# Altium schematic sheet Regulator.SchDoc
size A1
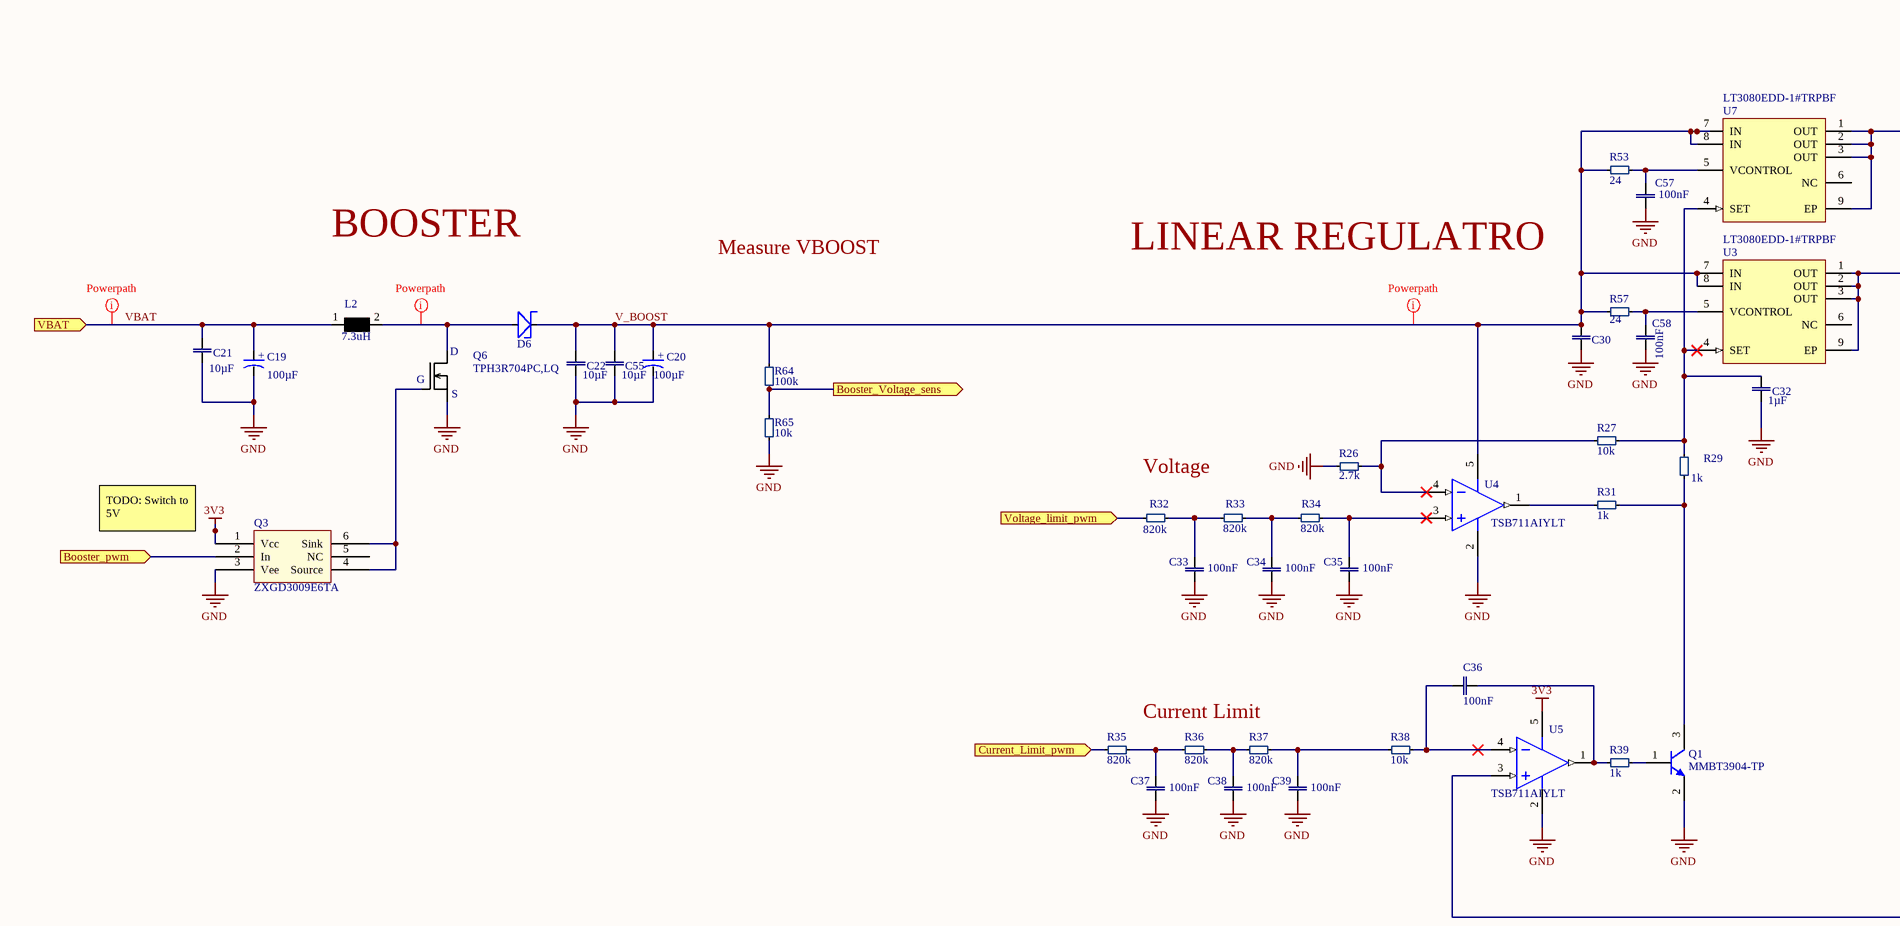
[diagram p0: Regulator.SchDoc, left]
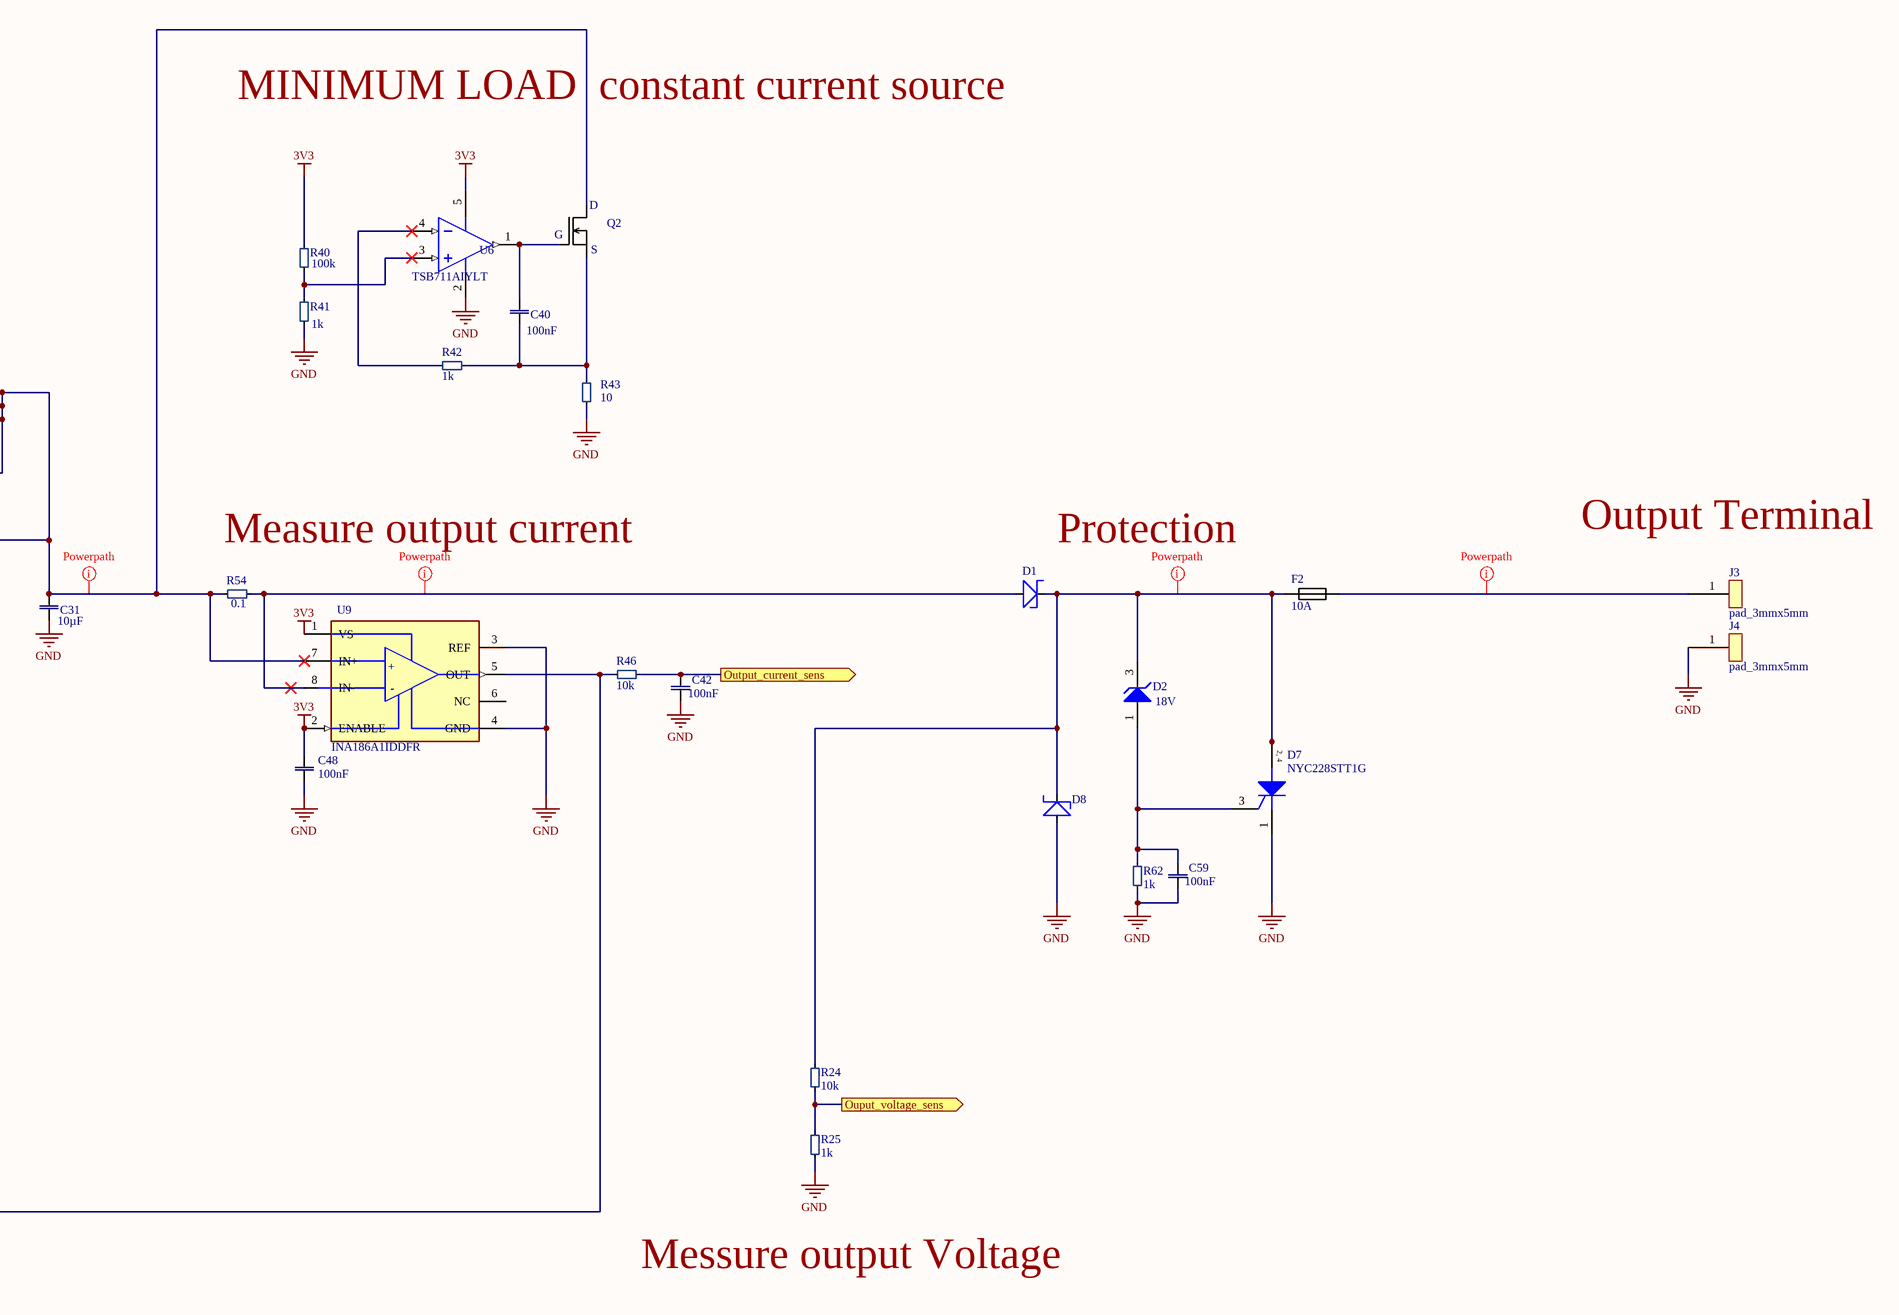
[diagram p1: Regulator.SchDoc, right]

## Parts
C19  Capacitance: 100µF  [CAPAE7966X77N]  (hidden comment: 865080545012)
C20  Capacitance: 100µF  [CAPAE7966X77N]  (hidden comment: 865080545012)
C21  Capacitance: 10µF  [Chip2PinSM127P600-8N]  (hidden comment: CL31A106MBHNNNE)
C22  Capacitance: 10µF  [Chip2PinSM127P600-8N]  (hidden comment: CL31A106MBHNNNE)
C30  CL21B105KBFNNNG  [CAP0805]  (value not drawn)
C31  Capacitance: 10µF  [Chip2PinSM127P600-8N]  (hidden comment: CL31A106MBHNNNE)
C32  Capacitance: 1µF  [CAP0805]  (hidden comment: CL21B105KBFNNNG)
C33  Capacitance: 100nF  [cap0402]  (hidden comment: GRM155R71H104ME14D)
C34  Capacitance: 100nF  [cap0402]  (hidden comment: GRM155R71H104ME14D)
C35  Capacitance: 100nF  [cap0402]  (hidden comment: GRM155R71H104ME14D)
C36  Capacitance: 100nF  [cap0402]  (hidden comment: GRM155R71H104ME14D)
C37  Capacitance: 100nF  [cap0402]  (hidden comment: GRM155R71H104ME14D)
C38  Capacitance: 100nF  [cap0402]  (hidden comment: GRM155R71H104ME14D)
C39  Capacitance: 100nF  [cap0402]  (hidden comment: GRM155R71H104ME14D)
C40  Capacitance: 100nF  [cap0402]  (hidden comment: GRM155R71H104ME14D)
C42  Capacitance: 100nF  [cap0402]  (hidden comment: GRM155R71H104ME14D)
C48  Capacitance: 100nF  [cap0402]  (hidden comment: GRM155R71H104ME14D)
C55  Capacitance: 10µF  [Chip2PinSM127P600-8N]  (hidden comment: CL31A106MBHNNNE)
C57  Capacitance: 100nF  [cap0402]  (hidden comment: GRM155R71H104ME14D)
C58  Capacitance: 100nF  [cap0402]  (hidden comment: GRM155R71H104ME14D)
C59  Capacitance: 100nF  [cap0402]  (hidden comment: GRM155R71H104ME14D)
D1  MBR12100LPS-TP  [DFN445P552X120-3N]  (value not drawn)
D2  Vz: 18V  [ONSC-SOT-23-3-318-08_V]  (hidden comment: BZX84C18LT3G)
D6  MBR12100LPS-TP  [DFN445P552X120-3N]  (value not drawn)
D7  NYC228STT1G  [ONSC-SOT-223-4-318E-04_V]
D8  MBR12100LPS-TP  [DFN445P552X120-3N]  (value not drawn)
F2  current rating: 10A  [RESC3216X06N]  (hidden comment: 0685H9100-01)
J3  pad_3mmx5mm  [pad_3mmx5mm-Footprint-1]  (no BOM)
J4  pad_3mmx5mm  [pad_3mmx5mm-Footprint-1]  (no BOM)
L2  Inductance: 7.3uH  [INDP130128X65N]  (hidden comment: 7443551730)
Q1  MMBT3904-TP  [ONSC-SOT-23-3-318-08_V]
Q2  PMN55ENEX  [TSOP95P280X110-6N_PMN55ENE]  (value not drawn)
Q3  ZXGD3009E6TA  [SOT95P285X110-6N]
Q6  TPH3R704PC,LQ  [TPH3R704PC,LQ-Footprint-1]
R24  Resistance: 10k  [SMD_0402(1005)_M]  (hidden comment: RC0402FR-0710KL)
R25  Resistance: 1k  [SMD_0402(1005)_M]  (hidden comment: RC0402FR-071KL)
R26  Resistance: 2.7k  [RESC1005X40X25NL05T10]  (hidden comment: RC0402FR-072K7L)
R27  Resistance: 10k  [SMD_0402(1005)_M]  (hidden comment: RC0402FR-0710KL)
R29  Resistance: 1k  [SMD_0402(1005)_M]  (hidden comment: RC0402FR-071KL)
R31  Resistance: 1k  [SMD_0402(1005)_M]  (hidden comment: RC0402FR-071KL)
R32  Resistance: 820k  [SMD_0402(1005)_M]  (hidden comment: RC0402FR-07820KL)
R33  Resistance: 820k  [SMD_0402(1005)_M]  (hidden comment: RC0402FR-07820KL)
R34  Resistance: 820k  [SMD_0402(1005)_M]  (hidden comment: RC0402FR-07820KL)
R35  Resistance: 820k  [SMD_0402(1005)_M]  (hidden comment: RC0402FR-07820KL)
R36  Resistance: 820k  [SMD_0402(1005)_M]  (hidden comment: RC0402FR-07820KL)
R37  Resistance: 820k  [SMD_0402(1005)_M]  (hidden comment: RC0402FR-07820KL)
R38  Resistance: 10k  [SMD_0402(1005)_M]  (hidden comment: RC0402FR-0710KL)
R39  Resistance: 1k  [SMD_0402(1005)_M]  (hidden comment: RC0402FR-071KL)
R40  Resistance: 100k  [SMD_0402(1005)_M]  (hidden comment: RC0402FR-07100KL)
R41  Resistance: 1k  [SMD_0402(1005)_M]  (hidden comment: RC0402FR-071KL)
R42  Resistance: 1k  [SMD_0402(1005)_M]  (hidden comment: RC0402FR-071KL)
R43  Resistance: 10  [SMD_0402(1005)_M]  (hidden comment: RC0402FR-0710RL)
R46  Resistance: 10k  [SMD_0402(1005)_M]  (hidden comment: RC0402FR-0710KL)
R53  Resistance: 24  [RESC0402(1005)_N]  (hidden comment: RC0402FR-0724RL)
R54  Resistance: 0.1  [Chip2PinSM127P600-8N]  (hidden comment: ERJ-8BSFR10V)
R57  Resistance: 24  [RESC0402(1005)_N]  (hidden comment: RC0402FR-0724RL)
R62  Resistance: 1k  [SMD_0402(1005)_M]  (hidden comment: RC0402FR-071KL)
R64  Resistance: 100k  [SMD_0402(1005)_M]  (hidden comment: RC0402FR-07100KL)
R65  Resistance: 10k  [SMD_0402(1005)_M]  (hidden comment: RC0402FR-0710KL)
U3  LT3080EDD-1#TRPBF  [LT-DD-8_V]
U4  TSB711AIYLT  [DBV0005A_N]
U5  TSB711AIYLT  [DBV0005A_N]
U6  TSB711AIYLT  [DBV0005A_N]
U7  LT3080EDD-1#TRPBF  [LT-DD-8_V]
U9  INA186A1IDDFR  [FP-DDF0008A-IPC_C]

## Ports
Booster_pwm (in), Booster_Voltage_sens (out), Current_Limit_pwm (in), Ouput_voltage_sens (out), Output_current_sens (out), VBAT (in), Voltage_limit_pwm (in)

## Nets
3V3: C48.2 Q3.1(Vcc) R40.2 U5.5(V+) U6.5(V+) U9.1(VS) U9.2(ENABLE)
GND: C19.2(-) C20.2(-) C21.1 C22.1 C30.1 C31.1 C32.1 C33.1 C34.1 C35.1 C37.1 C38.1 C39.1 C42.1 C48.1 C55.1 C57.1 C58.1 C59.1 D7.1(K) D8.2(A) J4.1 Q1.2(E) Q3.3(Vee) Q6.1(D) R25.1 R26.1 R41.1 R43.1 R62.1 R65.1 U4.2(V-) U5.2(V-) U6.2(V-) U9.3(REF) U9.4(GND)
Booster_pwm: Q3.2(In) ; port Booster_pwm
Booster_Voltage_sens: R64.1 R65.2 ; port Booster_Voltage_sens
Current_Limit_pwm: R35.1 ; port Current_Limit_pwm
Ouput_voltage_sens: R24.1 R25.2 ; port Ouput_voltage_sens
Output_current_sens: C42.2 R46.1 ; port Output_current_sens
V_BOOST: C20.1(+) C22.2 C30.2 C55.2 D6.1(K) R53.1 R57.1 R64.2 U3.7(IN) U3.8(IN) U4.5(V+) U7.7(IN) U7.8(IN)
VBAT: C19.1(+) C21.2 L2.1 ; port VBAT
Voltage_limit_pwm: R32.1 ; port Voltage_limit_pwm
NetC31_2: C31.2 Q2.2(S) R54.1 U3.1(OUT) U3.2(OUT) U3.3(OUT) U3.9(EP) U7.1(OUT) U7.2(OUT) U7.3(OUT) U7.9(EP) U9.7(IN+)
NetC32_2: C32.2 R27.2 R29.2 U3.4(SET) U7.4(SET)
NetC33_2: C33.2 R32.2 R33.1
NetC34_2: C34.2 R33.2 R34.1
NetC35_2: C35.2 R34.2 U4.3(IN+)
NetC36_1: C36.1 R39.2 U5.1(OUT)
NetC36_2: C36.2 R38.2 U5.4(IN-)
NetC37_2: C37.2 R35.2 R36.1
NetC38_2: C38.2 R36.2 R37.1
NetC39_2: C39.2 R37.2 R38.1
NetC40_1: C40.1 Q2.1(D) R42.1 R43.2
NetC40_2: C40.2 Q2.3(G) U6.1(OUT)
NetC57_2: C57.2 R53.2 U7.5(VCONTROL)
NetC58_2: C58.2 R57.2 U3.5(VCONTROL)
NetC59_2: C59.2 D2.1(A) D7.3(G) R62.2
NetD1_1: D1.1(K) D2.3(K) D7.2(A) D7.4(A) D8.1(K) F2.1 R24.2
NetD1_2: D1.2(A) R54.2 U9.8(IN-)
NetD6_2: D6.2(A) L2.2 Q6.2(S)
NetF2_2: F2.2 J3.1
NetQ1_1: Q1.1(B) R39.1
NetQ1_3: Q1.3(C) R29.1 R31.1
NetQ3_4: Q3.4(Source) Q3.6(Sink) Q6.3(G)
NetR26_2: R26.2 R27.1 U4.4(IN-)
NetR31_2: R31.2 U4.1(OUT)
NetR40_1: R40.1 R41.2 U6.3(IN+)
NetR42_2: R42.2 U6.4(IN-)
NetR46_2: R46.2 U5.3(IN+) U9.5(OUT)

Not connected (* = marked no-connect by the designer): Q3 5(NC); U3 6(NC); U7 6(NC); U9 6(NC)

## Layout directives
net class Powerpath: NetC31_2, NetD1_1, NetD1_2, NetD6_2, NetF2_2, V_BOOST, VBAT

## Notes on the sheet
- MINIMUM LOAD  constant current source
- BOOSTER
- Measure VBOOST
- LINEAR REGULATRO
- (near R54) Measure output current
- Protection
- Output Terminal
- Voltage
- TODO: Switch to 5V
- Current Limit
- Messure output Voltage
- (in symbol CMP-00013-1) 2, 4
- (in symbol CMP-ROOT-00032-7) +; -

## Library data of the parts
C19 C20 = CMP-0001-00027-2: Cap Aluminum Lytic 100uF 35V 20% (6.3 X 7.7mm) SMD 300mA 2000h 105C T/R; Capacitor Type: Ceramic; Voltage Rating: 35V; Case/Package: Radial; Tolerance: 20%; Mount: Surface Mount; RoHS: Yes; LCSC Part#: -
C21 C22 C55 = CMP-0001-00015-4: CAP CER 10UF 50V X5R 1206; Tolerance: 20%; Capacitor Type: Ceramic; Packaging: Tape and Reel; Case Code (Metric): 3216; Voltage Rating: 50V; Voltage Rating (DC): 50V; RoHS: Yes; Case Code (Imperial): 1206; Thickness: 0.071inch; Min Operating Temperature: -55°C; Dielectric: X5R; Width: 0.063inch; Max Operating Temperature: 85°C; Case/Package: 1206; Mount: Surface Mount; Length: 0.126inch; LCSC Part#: C96600
C30 = CMP-0001-00012-5: SAMSUNG ELECTRO-MECHANICS - CL21B105KBFNNNG - MLCC CAPACITORS; Voltage Rating: 50V; Dielectric: X7R; Material: Ceramic; Capacitance: 1µF; Tolerance: 10%; RoHS: Yes; Termination: Wraparound; Case Code (Imperial): 0805; Min Operating Temperature: -55°C; Package Quantity: 3000; Packaging: Tape and Reel; Length: 2mm; Width: 0.049inch; Thickness: 0.053inch; Mount: Surface Mount; Contact Plating: Tin; Voltage: 50V; Max Operating Temperature: 125°C; Case Code (Metric): 2012; Depth: 1.25mm; Case/Package: 0805; Capacitor Type: Ceramic; LCSC Part#: -
C31 = CMP-0001-00015-4: CAP CER 10UF 50V X5R 1206; Capacitor Type: Ceramic; Tolerance: 20%; Thickness: 0.071inch; Mount: Surface Mount; Dielectric: X5R; Length: 0.126inch; Case/Package: 1206; Width: 0.063inch; Voltage Rating (DC): 50V; Max Operating Temperature: 85°C; Case Code (Imperial): 1206; Voltage Rating: 50V; Min Operating Temperature: -55°C; Packaging: Tape and Reel; Case Code (Metric): 3216; RoHS: Yes; LCSC Part#: C96600
C32 = CMP-0001-00012-5: SAMSUNG ELECTRO-MECHANICS - CL21B105KBFNNNG - MLCC CAPACITORS; Voltage Rating: 50V; Dielectric: X7R; Material: Ceramic; Tolerance: 10%; RoHS: Yes; Termination: Wraparound; Case Code (Imperial): 0805; Min Operating Temperature: -55°C; Package Quantity: 3000; Packaging: Tape and Reel; Length: 2mm; Width: 0.049inch; Thickness: 0.053inch; Mount: Surface Mount; Contact Plating: Tin; Voltage: 50V; Max Operating Temperature: 125°C; Case Code (Metric): 2012; Depth: 1.25mm; Case/Package: 0805; Capacitor Type: Ceramic; LCSC Part#: -
C33-C39 C57 C58 = CMP-0001-00001-10: 0402 0.1 uF 50 V ±20% Tolerance X7R SMT Monolithic Ceramic Chip Capacitor; Voltage Rating: 50V; Value: 100nF; Pins: 2; Tolerance: 20%; Length: 0.039inch; Min Operating Temperature: -55°C; Max Operating Temperature: 125°C; Thickness: 0.022inch; Width: 0.02inch; Capacitor Type: Ceramic; Mount: Surface Mount; RoHS: Yes; Packaging: Cut Tape; Case/Package: 0402; LCSC Part#: C182412
C40 C42 C48 C59 = CMP-0001-00001-10: 0402 0.1 uF 50 V ±20% Tolerance X7R SMT Monolithic Ceramic Chip Capacitor; Value: 100nF; Voltage Rating: 50V; Length: 0.039inch; Packaging: Cut Tape; Max Operating Temperature: 125°C; Min Operating Temperature: -55°C; Mount: Surface Mount; Case/Package: 0402; Tolerance: 20%; Width: 0.02inch; Capacitor Type: Ceramic; Thickness: 0.022inch; Pins: 2; RoHS: Yes; LCSC Part#: C182412
D1 D6 D8 = CMP-ROOT-00021-3: Diode Schottky 100V 12A TO277B; Case/Package: TO-277, 3-PowerDFN; RoHS: Yes; Max Reverse Voltage (DC): 100V; Mount: Surface Mount; Packaging: Tape and Reel; Average Rectified Current: 12A; LCSC Part#: -
D2 = CMP-ROOT-00049-3: Diode, Zener, Vr 18V, If 10mA, Pkg SOT-23 (TO-236), Vf 0.9V, Cj 100pF, Tj +150C, Ir 5mA; RoHS: Yes; Case/Package: SOT-23-3; Mount: SMD
D7 = CMP-00013-1: Thyristor SCR 600V 15A 4-Pin(3+Tab) SOT-223 T/R; Hold Current: 5mA; RMS Current (Irms): 1.5A; Packaging: Tape and Reel; Max Repetitive Reverse Voltage (Vrrm): 600V; Package Quantity: 1000; Min Operating Temperature: -40°C; RoHS Compliant: Yes; Series: -; Halogen Free: Halogen Free; Lead Free: Lead Free; Max Operating Temperature: 110°C; Number of Pins: 4; Case/Package: SOT-223-4
F2 = CMP-ROOT-00047-2: Fuse Chip Fast Acting 10A 125V SMD Solder Pad 1206 3.2 X 1.58 X 0.65mm Ceramic T/R Automotive; Case/Package: 1206; RoHS: Yes; Mount: Surface Mount
J3 J4 = CMP-003-0007-2: pad for soldering on wires; Number of Positions: 1; System: Connector; RoHS: Yes; Mount: smd
L2 = CMP-ROOT-00003-2: WURTH ELEKTRONIK         7443551730             Surface Mount Power Inductor, WE-HCI Series, 7.3 H, 13 A, 12 A, Shielded, 5900 ohm; Tolerance: 20%; Max DC Current: 13A; DC Resistance (DCR): 5.9mR; Saturation Current: 12A; Series Resistance: 5.9R; Test Frequency: 100kHz; Self Resonant Frequency: 28MHz; Case/Package: 1365; Packaging: Tape and Reel; Shielding: Shielded; Width: 12.8mm; Package Quantity: 400; Composition: Wirewound; Lead Free: Lead Free; Min Operating Temperature: -40°C; Mount: Surface Mount; Current Rating: 13A; RMS Current (Irms): 13A; Termination: SMD/SMT; REACH SVHC: Unknown; RoHS: Yes; Inductance Tolerance: 20%; Number of Pins: 2; Depth: 12.8mm; Height: 6.2mm; Max Operating Temperature: 155°C; Height - Seated (Max): 0.256inch; Length: 13.2mm; LCSC Part#: C1331154
Q1 = CMP-014-0001-2: TRANS NPN 40V 0.2A SOT23; Frequency: 300MHz; Emitter Base Voltage (VEBO): 6V; Number of Elements: 1; Max Collector Current: 200mA; Power Dissipation: 350mW; Collector Emitter Saturation Voltage: 300mV; Element Configuration: Single; Collector Base Voltage (VCBO): 60V; hFE Min: 40; Current Rating: 100mA; Mount: Surface Mount; Polarity: NPN; Width: 1.4mm; Max Power Dissipation: 350mW; Collector Emitter Voltage (VCEO): 40V; Case/Package: SOT-23; Package Quantity: 1; Voltage Rating (DC): 40V; Number of Pins: 3; Collector Emitter Breakdown Voltage: 40V; Packaging: Tape and Reel; Transition Frequency: 300MHz; Radiation Hardening: No; Length: 3.04mm; Max Breakdown Voltage: 40V; RoHS: Yes; Max Frequency: 300MHz; Lead Free: Lead Free; Gain Bandwidth Product: 300MHz; Min Operating Temperature: -55°C; Max Operating Temperature: 150°C; Height: 1.12mm; LCSC Part#: C77991
Q2 = CMP-ROOT-00001-5: MOSFET N-CH 60V 4.5A 6TSOP; Input Capacitance: 646pF; Rds On Max: 60mR; Max Power Dissipation: 6.25mW; Mount: Surface Mount; Case/Package: TSOP; Max Operating Temperature: 150°C; Min Operating Temperature: -55°C; Packaging: Tape and Reel; Drain to Source Voltage (Vdss): 60V; RoHS: Yes; Continuous Drain Current (ID): 4.5A; LCSC Part#: C552991
Q3 = CMP-006-0007-3: IC GATE DRVR IGBT/MOSFET SOT23-6; LCSC Part#: C156293
Q6 = CMP-ROOT-00043-2: MOSFET N-Channel Enhancement Mode 40V 8-Pin SOP; RoHS: Yes; Mount: SMD; Case/Package: 8-PowerVDFN; LCSC Part#: -
R24 R46 R65 = CMP-008-0005-11: Surface Mount Thick Film Resistor, Rc Series, 10 Kohm, 62.5 Mw, - 1%, 50 V, 0402 [1005 Metric]; Voltage Rating: 50V; Power Rating: 62.5mW; Value: 10k; Temperature Coefficient: 100ppm/°C; Case/Package: 0402; Lead Pitch: 0.2mm; Tolerance: 1%; Composition: Thick Film; Voltage Rating (DC): 50V; Case Code (Metric): 1005; Width: 0.5mm; Lead Free: Lead Free; Number of Terminations: 2; Number of Pins: 2; Mount: SMD; Termination: SMD/SMT; Military Standard: Not; REACH SVHC: No SVHC; Length: 1mm; Depth: 0.5mm; Working Voltage: 50V; Packaging: Tape and Reel; Case Code (Imperial): 0402; Max Operating Temperature: 155°C; Height: 0.32mm; RoHS: Yes; Min Operating Temperature: -55°C; LCSC Part#: C60490
R25 R62 = CMP-001-0000-9: Surface Mount Chip Resistor, Thick Film, RC Series, 1 kohm, 62.5 mW, 1%, 50 V, 0402 [1005 Metric]; Voltage Rating: 50V; Power Rating: 62.5mW; Value: 1k; Temperature Coefficient: 100ppm/°C; Case/Package: 0402; Tolerance: 1%; Composition: Thick Film; Voltage Rating (DC): 50V; Case Code (Metric): 1005; Width: 0.5mm; Lead Free: Lead Free; Number of Pins: 2; Mount: SMD; Termination: SMD/SMT; Military Standard: Not; REACH SVHC: Unknown; Length: 1mm; Depth: 0.5mm; Packaging: Tape and Reel; Case Code (Imperial): 0402; Max Operating Temperature: 155°C; Height: 0.32mm; RoHS: Yes; Min Operating Temperature: -55°C; LCSC Part#: C2935237
R26 = CMP-001-0025-2: Res General Purpose Thick Film 0402 2.7k Ohm 1% 1/16W ±100ppm/°C Molded Paper T/R; Value: 2.2k; Voltage Rating: 50V; Power Rating: 62.5mW; Composition: Thick Film; Packaging: Tape and Reel; Depth: 0.5mm; Case Code (Metric): 1005; Min Operating Temperature: -55°C; Width: 0.02inch; Mount: SMD; Weight: 2.3E-05oz; Max Operating Temperature: 155°C; REACH SVHC: Unknown; Military Standard: Not; Temperature Coefficient: 100ppm/°C; Length: 0.039inch; Case Code (Imperial): 0402; Tolerance: 1%; Case/Package: 0402; Termination: SMD/SMT; RoHS: Yes; Lead Free: Lead Free; Height: 0.016inch; LCSC Part#: C138017
R27 R38 = CMP-008-0005-11: Surface Mount Thick Film Resistor, Rc Series, 10 Kohm, 62.5 Mw, - 1%, 50 V, 0402 [1005 Metric]; Voltage Rating: 50V; Temperature Coefficient: 100ppm/°C; Power Rating: 62.5mW; Value: 10k; Case/Package: 0402; Lead Free: Lead Free; Case Code (Imperial): 0402; Termination: SMD/SMT; Max Operating Temperature: 155°C; Height: 0.32mm; Length: 1mm; Min Operating Temperature: -55°C; Case Code (Metric): 1005; Depth: 0.5mm; Mount: SMD; REACH SVHC: No SVHC; Military Standard: Not; Tolerance: 1%; Number of Pins: 2; Voltage Rating (DC): 50V; Composition: Thick Film; RoHS: Yes; Packaging: Tape and Reel; Width: 0.5mm; Lead Pitch: 0.2mm; Working Voltage: 50V; Number of Terminations: 2; LCSC Part#: C60490
R29 R31 R39 R41 R42 = CMP-001-0000-9: Surface Mount Chip Resistor, Thick Film, RC Series, 1 kohm, 62.5 mW, 1%, 50 V, 0402 [1005 Metric]; Temperature Coefficient: 100ppm/°C; Value: 1k; Voltage Rating: 50V; Power Rating: 62.5mW; RoHS: Yes; Max Operating Temperature: 155°C; Width: 0.5mm; Case Code (Metric): 1005; Mount: SMD; Min Operating Temperature: -55°C; Lead Free: Lead Free; Military Standard: Not; Case Code (Imperial): 0402; Number of Pins: 2; Height: 0.32mm; Case/Package: 0402; Composition: Thick Film; Packaging: Tape and Reel; Length: 1mm; Tolerance: 1%; Depth: 0.5mm; Voltage Rating (DC): 50V; Termination: SMD/SMT; REACH SVHC: Unknown; LCSC Part#: C2935237
R32-R37 = CMP-001-0026-2: Res Thick Film RC0402FR-07820KL 0402 820K Ohm 1% 0.063W(1/16W) ±100ppm/°C Pad SMD T/R; Voltage Rating: 50V; Power Rating: 63mW; Value: 10k; Case/Package: 0402; Lead Free: Lead Free; Case Code (Imperial): 0402; Termination: SMD/SMT; Max Operating Temperature: 155°C; Height: 0.016inch; Length: 1mm; Min Operating Temperature: -55°C; Case Code (Metric): 1005; Depth: 0.5mm; Mount: SMD; REACH SVHC: Unknown; Military Standard: Not; Temperature Coefficient: 100ppm/°C; Tolerance: 1%; Number of Pins: 2; Voltage Rating (DC): 50V; Composition: Thick Film; RoHS: Yes; Packaging: Tape and Reel; Width: 0.5mm; Lead Pitch: 0.2mm; Working Voltage: 50V; Number of Terminations: 2; LCSC Part#: C273727
R40 R64 = CMP-0001-00006-6: Res General Purpose Thick Film 0402 100K Ohm 1% 1/16W ±100ppm/°C Molded SMD Paper T/R; Max Power Dissipation: 63mW; Voltage Rating: 50V; Value: 100k; Termination: SMD/SMT; Tolerance: 1%; Length: 0.039inch; REACH SVHC: No SVHC; Features: Moisture Resistant; Mount: SMD; Power Rating: 63mW; Depth: 0.5mm; Max Operating Temperature: 155°C; Width: 0.02inch; Height: 0.016inch; Case Code (Metric): 1005; Temperature Coefficient: 100ppm/°C; Military Standard: Not; Case/Package: 0402; Lead Free: Lead Free; Working Voltage: 50V; Package Quantity: 1; Number of Terminations: 2; Min Operating Temperature: -55°C; Composition: Thick Film; RoHS: Yes; Packaging: Tape and Reel; Case Code (Imperial): 0402; LCSC Part#: C60491
R43 = CMP-0001-00007-5: RES SMD 10 OHM 1% 1/16W 0402; Temperature Coefficient: 100ppm/°C; Value: 10; Voltage Rating: 50V; Power Rating: 63mW; Case Code (Imperial): 0402; Lead Free: Lead Free; Height: 0.32mm; Case Code (Metric): 1005; Composition: Thick Film; Min Operating Temperature: -55°C; RoHS: Yes; Length: 1mm; Packaging: Tape and Reel; Working Voltage: 50V; Case/Package: 0402; Max Operating Temperature: 155°C; Number of Terminations: 2; Tolerance: 1%; Military Standard: Not; Mount: SMD; Depth: 0.5mm; REACH SVHC: Unknown; Termination: SMD/SMT; LCSC Part#: C138066
R53 R57 = CMP-0001-00017-5: Thick Film Resistors 24 OHM 1%; Voltage Rating (DC): 50V; Temperature Coefficient: 100ppm/°C; Max Power Dissipation: 63mW; Composition: Thick Film; REACH SVHC: No SVHC; Max Operating Temperature: 155°C; Case Code (Metric): 1005; Length: 1mm; Packaging: Tape and Reel; Height: 0.016inch; Features: Moisture Resistant; Mount: SMD; Number of Terminations: 2; Termination: SMD/SMT; Width: 0.02inch; RoHS: Yes; Number of Pins: 2; Lead Free: Lead Free; Case Code (Imperial): 0402; Case/Package: 0402; Working Voltage: 50V; Depth: 0.5mm; Military Standard: Not; Power Rating: 63mW; Min Operating Temperature: -55°C; Voltage Rating: 50V; Tolerance: 1%; LCSC Part#: C274890
R54 = CMP-0001-00003-4: Precision resistor, SMD 0.1 Ohm 0.33 W  ±  1 % 1206, ERJ8BSFR10V, Panasonic Automotive & Industrial Systems; Temperature Coefficient: 250ppm/°C; Tolerance: 1%; Value: 0.1; Max Power Dissipation: 500mW; Power Rating: 330mW; Length: 3.2mm; Width: 0.063inch; Number of Terminations: 2; Case Code (Metric): 3216; RoHS: Yes; Mount: Surface Mount; Military Standard: Not; Radiation Hardening: No; Contact Plating: Tin; Height: 0.6mm; Case Code (Imperial): 1206; Composition: Thick Film,Low-Ohm-Resistor; Min Operating Temperature: -55°C; Features: Automotive AEC-Q200; Max Operating Temperature: 125°C; Depth: 1.6mm; Packaging: Tape and Reel; Case/Package: 1206; Termination: SMD/SMT; Number of Pins: 2; Package Quantity: 5000; REACH SVHC: No SVHC; LCSC Part#: C2079636
U3 U7 = CMP-00012-3: LDO Regulator Pos 0V to 36V 1.1A 8-Pin DFN EP T/R; Operating Supply Current: 300uA; Quiescent Current: 500uA; Number of Regulators: 1; Min Input Voltage: 1.2V; Polarity: Positive; Dropout Voltage: 1.35V; Min Current Limit: 1.1A; Min Operating Temperature: -40°C; Packaging: Tape and Reel; Case/Package: DFN; Number of Pins: 8; Output Current: 1.1A; Max Operating Temperature: 125°C; Number of Outputs: 1; Output Voltage: 36V; Package Quantity: 2500; Max Input Voltage: 36V; RoHS Compliant: Yes; LCSC Part#: C670293
U4-U6 = CMP-ROOT-0004-3: Op Amp Single Precision Amplifier R-R I/O ±18V/36V Automotive 5-Pin SOT-23 T/R; Voltage Gain: 97.03dB; Output Current: 11mA; Number of Channels: 1; Common Mode Rejection Ratio: 70dB; Input Offset Voltage (Vos): 8mV; Bandwidth: 4MHz; Max Supply Voltage: 32V; Output Current per Channel: 11.7mA; Operating Supply Current: 720uA; Slew Rate: 1.25V/µs; Input Bias Current: 103nA; Nominal Supply Current: 600uA; Min Supply Voltage: 1.8V; Power Supply Rejection Ratio (PSRR): 87dB; Power Dissipation: 350mW; Min Dual Supply Voltage: 900mV; Max Dual Supply Voltage: 16V; Radiation Hardening: No; Number of Amplifiers: 1; Number of Circuits: 1; Gain Bandwidth Product: 4MHz; Unity Gain Bandwidth Product: 4MHz; Package Quantity: 1; RoHS: Yes; Mount: Surface Mount; REACH SVHC: No SVHC; Contact Plating: Tin,Lead; Packaging: Tape and Reel; Number of Pins: 5; Lead Free: Contains Lead; Case/Package: SOT-23; Number of Elements: 1; Max Operating Temperature: 85°C; Min Operating Temperature: -40°C; Max Power Dissipation: 350mW; LCSC Part#: -
U9 = CMP-ROOT-00032-7: 40V, bi-directional, high-precision current sense amplifier w/ picoamp IB & ENABLE 8-SOT-23-THIN -40 to 125; RoHS: Yes; Mount: SMD; Case/Package: SOT-23-8; LCSC Part#: C1852082